# Altium schematic sheet Hierarquia.SchDoc: Hierarquia
size A3; Address1: UFCG; Address2: Laboratório VIRTUS CC; Address3: Campina Grande, PB - Brasil; SheetNumber: 1; SheetTotal: 8; Project: HAT RPi 4 - Phase Shifter Fotônico; DocumentRev: 01; Version: v1.0; SCH_SCALE: N/A
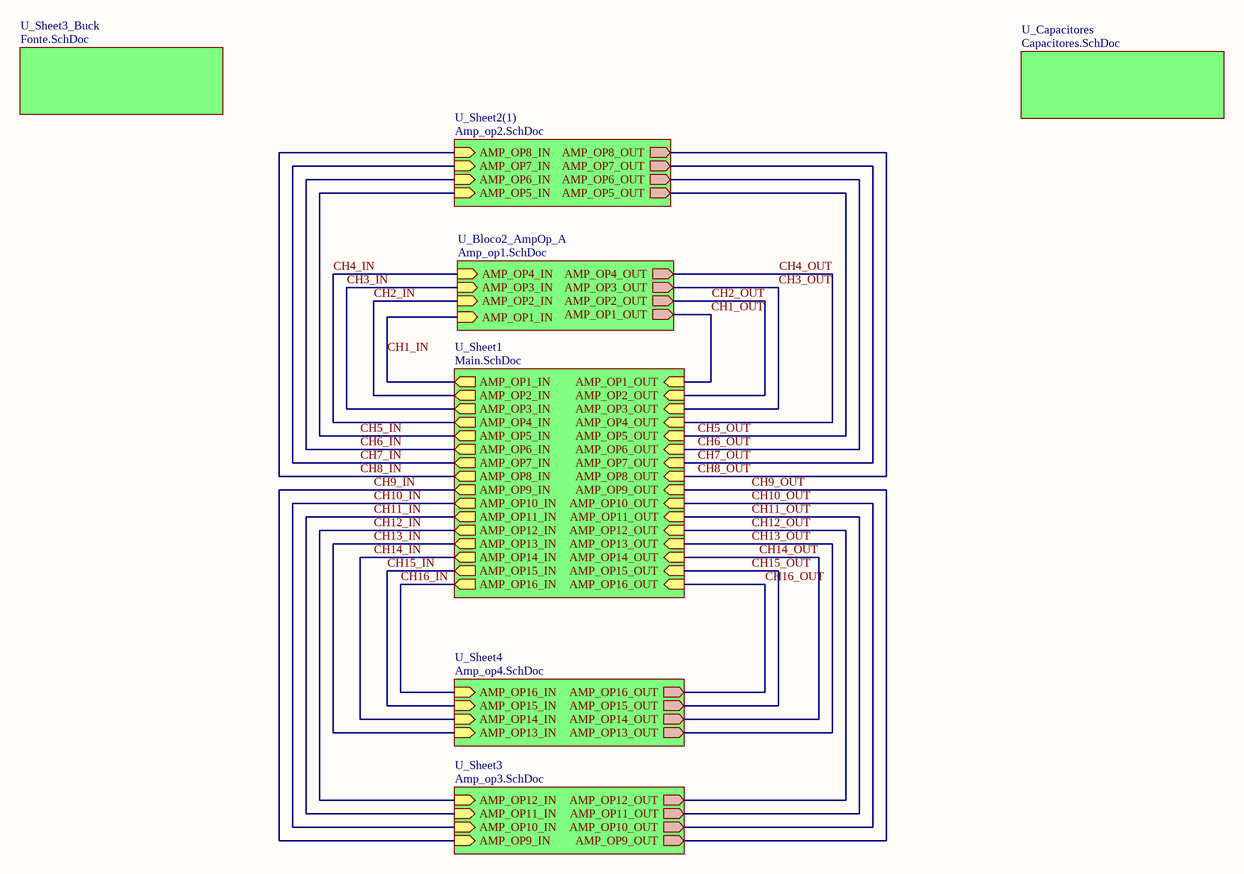
[diagram p0: Hierarquia.SchDoc]

## Sub-sheets
U_Bloco2_AmpOp_A = Amp_op1.SchDoc: AMP_OP4_IN (in), AMP_OP3_IN (in), AMP_OP2_IN (in), AMP_OP1_IN (in), AMP_OP1_OUT (out), AMP_OP2_OUT (out), AMP_OP3_OUT (out), AMP_OP4_OUT (out)
U_Capacitores = Capacitores.SchDoc: no entries
U_Sheet1 = Main.SchDoc: AMP_OP1_IN (out), AMP_OP2_IN (out), AMP_OP3_IN (out), AMP_OP4_IN (out), AMP_OP1_OUT (in), AMP_OP2_OUT (in), AMP_OP3_OUT (in), AMP_OP4_OUT (in), AMP_OP5_IN (out), AMP_OP6_IN (out), AMP_OP7_IN (out), AMP_OP8_IN (out), AMP_OP5_OUT (in), AMP_OP6_OUT (in), AMP_OP7_OUT (in), AMP_OP8_OUT (in), AMP_OP9_IN (out), AMP_OP10_IN (out), AMP_OP11_IN (out), AMP_OP12_IN (out), AMP_OP13_IN (out), AMP_OP14_IN (out), AMP_OP15_IN (out), AMP_OP16_IN (out), AMP_OP9_OUT (in), AMP_OP10_OUT (in), AMP_OP11_OUT (in), AMP_OP12_OUT (in), AMP_OP13_OUT (in), AMP_OP14_OUT (in), AMP_OP15_OUT (in), AMP_OP16_OUT (in)
U_Sheet2(1) = Amp_op2.SchDoc: AMP_OP7_OUT (out), AMP_OP5_OUT (out), AMP_OP6_OUT (out), AMP_OP8_OUT (out), AMP_OP5_IN (in), AMP_OP6_IN (in), AMP_OP7_IN (in), AMP_OP8_IN (in)
U_Sheet3 = Amp_op3.SchDoc: AMP_OP9_OUT (out), AMP_OP10_OUT (out), AMP_OP12_OUT (out), AMP_OP9_IN (in), AMP_OP10_IN (in), AMP_OP11_IN (in), AMP_OP12_IN (in), AMP_OP11_OUT (out)
U_Sheet3_Buck = Fonte.SchDoc: no entries
U_Sheet4 = Amp_op4.SchDoc: AMP_OP16_OUT (out), AMP_OP13_OUT (out), AMP_OP15_OUT (out), AMP_OP14_OUT (out), AMP_OP13_IN (in), AMP_OP14_IN (in), AMP_OP15_IN (in), AMP_OP16_IN (in)

## Nets
CH1_IN: sheet U_Bloco2_AmpOp_A/AMP_OP1_IN, sheet U_Sheet1/AMP_OP1_IN
CH1_OUT: sheet U_Bloco2_AmpOp_A/AMP_OP1_OUT, sheet U_Sheet1/AMP_OP1_OUT
CH2_IN: sheet U_Bloco2_AmpOp_A/AMP_OP2_IN, sheet U_Sheet1/AMP_OP2_IN
CH2_OUT: sheet U_Bloco2_AmpOp_A/AMP_OP2_OUT, sheet U_Sheet1/AMP_OP2_OUT
CH3_IN: sheet U_Bloco2_AmpOp_A/AMP_OP3_IN, sheet U_Sheet1/AMP_OP3_IN
CH3_OUT: sheet U_Bloco2_AmpOp_A/AMP_OP3_OUT, sheet U_Sheet1/AMP_OP3_OUT
CH4_IN: sheet U_Bloco2_AmpOp_A/AMP_OP4_IN, sheet U_Sheet1/AMP_OP4_IN
CH4_OUT: sheet U_Bloco2_AmpOp_A/AMP_OP4_OUT, sheet U_Sheet1/AMP_OP4_OUT
CH5_IN: sheet U_Sheet1/AMP_OP5_IN, sheet U_Sheet2(1)/AMP_OP5_IN
CH5_OUT: sheet U_Sheet1/AMP_OP5_OUT, sheet U_Sheet2(1)/AMP_OP5_OUT
CH6_IN: sheet U_Sheet1/AMP_OP6_IN, sheet U_Sheet2(1)/AMP_OP6_IN
CH6_OUT: sheet U_Sheet1/AMP_OP6_OUT, sheet U_Sheet2(1)/AMP_OP6_OUT
CH7_IN: sheet U_Sheet1/AMP_OP7_IN, sheet U_Sheet2(1)/AMP_OP7_IN
CH7_OUT: sheet U_Sheet1/AMP_OP7_OUT, sheet U_Sheet2(1)/AMP_OP7_OUT
CH8_IN: sheet U_Sheet1/AMP_OP8_IN, sheet U_Sheet2(1)/AMP_OP8_IN
CH8_OUT: sheet U_Sheet1/AMP_OP8_OUT, sheet U_Sheet2(1)/AMP_OP8_OUT
CH9_IN: sheet U_Sheet1/AMP_OP9_IN, sheet U_Sheet3/AMP_OP9_IN
CH9_OUT: sheet U_Sheet1/AMP_OP9_OUT, sheet U_Sheet3/AMP_OP9_OUT
CH10_IN: sheet U_Sheet1/AMP_OP10_IN, sheet U_Sheet3/AMP_OP10_IN
CH10_OUT: sheet U_Sheet1/AMP_OP10_OUT, sheet U_Sheet3/AMP_OP10_OUT
CH11_IN: sheet U_Sheet1/AMP_OP11_IN, sheet U_Sheet3/AMP_OP11_IN
CH11_OUT: sheet U_Sheet1/AMP_OP11_OUT, sheet U_Sheet3/AMP_OP11_OUT
CH12_IN: sheet U_Sheet1/AMP_OP12_IN, sheet U_Sheet3/AMP_OP12_IN
CH12_OUT: sheet U_Sheet1/AMP_OP12_OUT, sheet U_Sheet3/AMP_OP12_OUT
CH13_IN: sheet U_Sheet1/AMP_OP13_IN, sheet U_Sheet4/AMP_OP13_IN
CH13_OUT: sheet U_Sheet1/AMP_OP13_OUT, sheet U_Sheet4/AMP_OP13_OUT
CH14_IN: sheet U_Sheet1/AMP_OP14_IN, sheet U_Sheet4/AMP_OP14_IN
CH14_OUT: sheet U_Sheet1/AMP_OP14_OUT, sheet U_Sheet4/AMP_OP14_OUT
CH15_IN: sheet U_Sheet1/AMP_OP15_IN, sheet U_Sheet4/AMP_OP15_IN
CH15_OUT: sheet U_Sheet1/AMP_OP15_OUT, sheet U_Sheet4/AMP_OP15_OUT
CH16_IN: sheet U_Sheet1/AMP_OP16_IN, sheet U_Sheet4/AMP_OP16_IN
CH16_OUT: sheet U_Sheet1/AMP_OP16_OUT, sheet U_Sheet4/AMP_OP16_OUT

## Notes on the sheet
- REVISION
- DESCRIPTION
- DATE
- APPROVED
- ADDRESS
- PROJECT
- VERSION
- TITLE
- A3
- SIZE
- SCALE
- DOCUMENT NAME:
- DOCUMENT REVISION:
- OF
- SHEET:
- PROJECT REVISION: